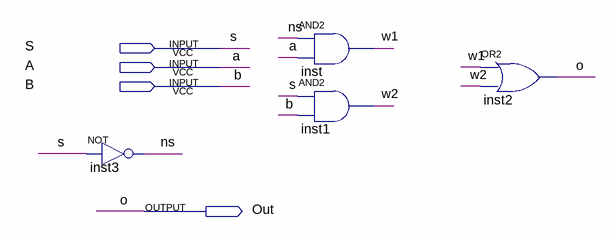
[diagram p0: schematic sheet]
// Quartus schematic mux2to1_1bit.bdf as structural Verilog: 4 symbols, 4 pins
module mux2to1_1bit (
  input  S,
  input  A,
  input  B,
  output Out
);

  wire ns, w1, w2;

  not inst3 (ns, S);
  and inst (w1, ns, A);
  and inst1 (w2, S, B);
  or inst2 (Out, w1, w2);

  // Other names for the same wires on the sheet: o = Out
endmodule
